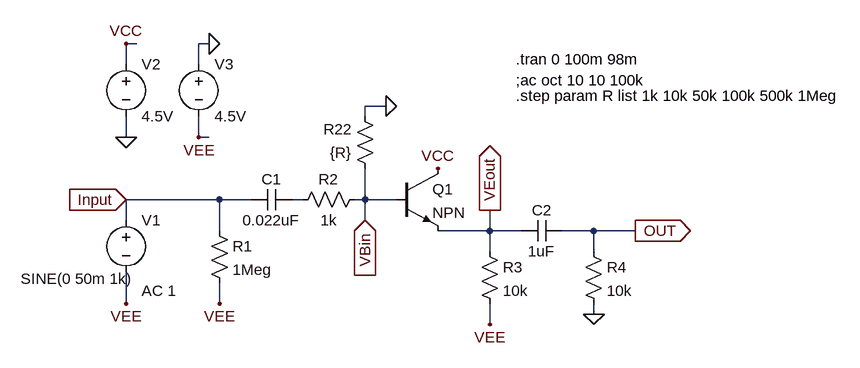
[diagram p0: schematic Input_Voltage.asc]
Input_Voltage.asc, the LTspice schematic file:
Version 4
SHEET 1 2708 1284
WIRE 128 -128 112 -128
WIRE 240 -128 224 -128
WIRE 112 -96 112 -128
WIRE 224 -96 224 -128
WIRE 512 -32 480 -32
WIRE 480 -16 480 -32
WIRE 112 16 112 -16
WIRE 224 16 224 -16
WIRE 240 16 224 16
WIRE 256 112 112 112
WIRE 304 112 256 112
WIRE 384 112 368 112
WIRE 480 112 480 64
WIRE 480 112 464 112
WIRE 528 112 480 112
WIRE 112 144 112 112
WIRE 480 144 480 112
WIRE 256 160 256 112
WIRE 672 160 672 128
WIRE 672 160 592 160
WIRE 720 160 672 160
WIRE 832 160 784 160
WIRE 896 160 832 160
WIRE 672 192 672 160
WIRE 832 192 832 160
WIRE 112 272 112 224
WIRE 256 272 256 240
WIRE 832 288 832 272
WIRE 672 304 672 272
FLAG 592 64 VCC
FLAG 112 112 Input
IOPIN 112 112 In
FLAG 112 -128 VCC
FLAG 896 160 OUT
IOPIN 896 160 Out
FLAG 240 -128 0
FLAG 224 16 VEE
FLAG 112 272 VEE
FLAG 256 272 VEE
FLAG 672 304 VEE
FLAG 832 288 0
FLAG 112 16 0
FLAG 480 144 VBin
IOPIN 480 144 In
FLAG 672 128 VEout
IOPIN 672 128 Out
FLAG 512 -32 0
SYMBOL voltage 112 128 R0
WINDOW 123 24 124 Left 2
WINDOW 39 0 0 Left 2
WINDOW 3 -162 106 Left 2
SYMATTR Value2 AC 1
SYMATTR Value SINE(0 50m 1k)
SYMATTR InstName V1
SYMBOL res 240 144 R0
SYMATTR InstName R1
SYMATTR Value 1Meg
SYMBOL cap 368 96 R90
WINDOW 0 0 32 VBottom 2
WINDOW 3 32 32 VTop 2
SYMATTR InstName C1
SYMATTR Value 0.022uF
SYMBOL res 480 96 R90
WINDOW 0 0 56 VBottom 2
WINDOW 3 32 56 VTop 2
SYMATTR InstName R2
SYMATTR Value 1k
SYMBOL npn 528 64 R0
SYMATTR InstName Q1
SYMBOL res 656 176 R0
SYMATTR InstName R3
SYMATTR Value 10k
SYMBOL cap 784 144 R90
WINDOW 0 0 32 VBottom 2
WINDOW 3 32 32 VTop 2
SYMATTR InstName C2
SYMATTR Value 1uF
SYMBOL res 816 176 R0
SYMATTR InstName R4
SYMATTR Value 10k
SYMBOL res 496 80 R180
WINDOW 0 36 76 Left 2
WINDOW 3 36 40 Left 2
SYMATTR InstName R22
SYMATTR Value {R}
SYMBOL voltage 112 -112 R0
SYMATTR InstName V2
SYMATTR Value 4.5V
SYMBOL voltage 224 -112 R0
SYMATTR InstName V3
SYMATTR Value 4.5V
TEXT 712 -104 Left 2 !.tran 0 100m 98m
TEXT 712 -72 Left 2 !;ac oct 10 10 100k
TEXT 712 -48 Left 2 !.step param R list 1k 10k 50k 100k 500k 1Meg

The netlist it stands for:
* Input_Voltage.asc
V1 Input VEE SINE(0 50m 1k) AC 1
R1 Input VEE 1Meg
C1 N001 Input 0.022uF
R2 VBin N001 1k
Q1 VCC VBin VEout 0 NPN
R3 VEout VEE 10k
C2 OUT VEout 1uF
R4 OUT 0 10k
R22 VBin 0 {R}
V2 VCC 0 4.5V
V3 0 VEE 4.5V
.model NPN NPN
.model PNP PNP
.lib standard.bjt
.tran 0 100m 98m
;ac oct 10 10 100k
.step param R list 1k 10k 50k 100k 500k 1Meg
.backanno
.end